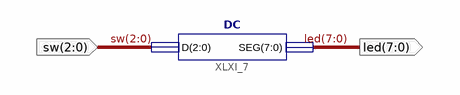
[diagram p0: schematic sheet 1]
// Xilinx ISE schematic scheme.sch (spartan6) as structural Verilog: 1 symbols, 2 ports
module scheme (
  input  [2:0] sw,
  output [7:0] led
);

  DC XLXI_7 (.D(sw), .SEG(led));
endmodule
